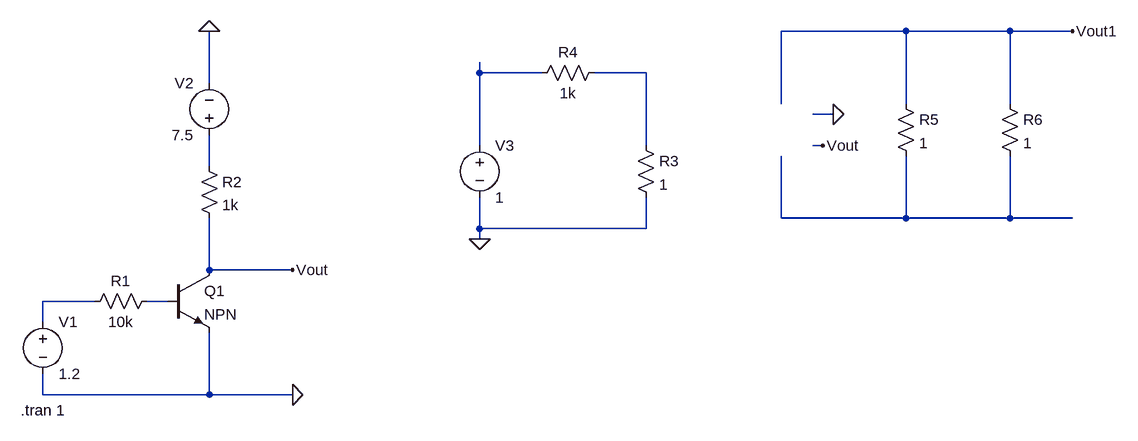
[diagram p0: schematic amplifier prac.asc]
amplifier prac.asc, the LTspice schematic file:
Version 4
SHEET 1 1620 680
WIRE 1280 -352 1088 -352
WIRE 1440 -352 1280 -352
WIRE 1536 -352 1440 -352
WIRE 624 -288 624 -304
WIRE 720 -288 624 -288
WIRE 880 -288 800 -288
WIRE 208 -272 208 -352
WIRE 1088 -240 1088 -352
WIRE 1280 -240 1280 -352
WIRE 1440 -240 1440 -352
WIRE 1168 -224 1136 -224
WIRE 624 -176 624 -288
WIRE 880 -176 880 -288
WIRE 1152 -176 1136 -176
WIRE 208 -144 208 -192
WIRE 1088 -64 1088 -160
WIRE 1280 -64 1280 -160
WIRE 1280 -64 1088 -64
WIRE 1440 -64 1440 -160
WIRE 1440 -64 1280 -64
WIRE 1536 -64 1440 -64
WIRE 624 -48 624 -96
WIRE 880 -48 880 -96
WIRE 880 -48 624 -48
WIRE 624 -32 624 -48
WIRE 208 16 208 -64
WIRE 336 16 208 16
WIRE 32 64 -48 64
WIRE 144 64 112 64
WIRE -48 96 -48 64
WIRE -48 208 -48 176
WIRE 208 208 208 112
WIRE 208 208 -48 208
WIRE 336 208 208 208
FLAG 208 -352 0
FLAG 336 208 0
FLAG 336 16 Vout
FLAG 624 -32 0
FLAG 1536 -352 Vout1
FLAG 1168 -224 0
FLAG 1152 -176 Vout
SYMBOL npn 144 16 R0
SYMATTR InstName Q1
SYMBOL voltage -48 80 R0
WINDOW 123 0 0 Left 0
WINDOW 39 0 0 Left 0
SYMATTR InstName V1
SYMATTR Value 1.2
SYMBOL res 128 48 R90
WINDOW 0 0 56 VBottom 2
WINDOW 3 32 56 VTop 2
SYMATTR InstName R1
SYMATTR Value 10k
SYMBOL res 192 -160 R0
SYMATTR InstName R2
SYMATTR Value 1k
SYMBOL voltage 208 -176 R180
WINDOW 0 24 96 Left 2
WINDOW 3 24 16 Left 2
WINDOW 123 0 0 Left 0
WINDOW 39 0 0 Left 0
SYMATTR InstName V2
SYMATTR Value 7.5
SYMBOL voltage 624 -192 R0
WINDOW 123 0 0 Left 0
WINDOW 39 0 0 Left 0
SYMATTR InstName V3
SYMATTR Value 1
SYMBOL res 864 -192 R0
SYMATTR InstName R3
SYMATTR Value 1
SYMBOL res 816 -304 R90
WINDOW 0 0 56 VBottom 2
WINDOW 3 32 56 VTop 2
SYMATTR InstName R4
SYMATTR Value 1k
SYMBOL res 1264 -256 R0
SYMATTR InstName R5
SYMATTR Value 1
SYMBOL res 1424 -256 R0
SYMATTR InstName R6
SYMATTR Value 1
TEXT -82 232 Left 2 !.tran 1

The netlist it stands for:
* amplifier prac.asc
Q1 Vout N006 0 0 NPN
V1 N005 0 1.2
R1 N006 N005 10k
R2 N003 Vout 1k
V2 N003 0 7.5
V3 N001 0 1
R3 N002 0 1
R4 N002 N001 1k
R5 Vout1 N004 1
R6 Vout1 N004 1
.model NPN NPN
.model PNP PNP
.lib standard.bjt
.tran 1
.backanno
.end